# EAGLE design powersense (EAGLE 9.1.2)
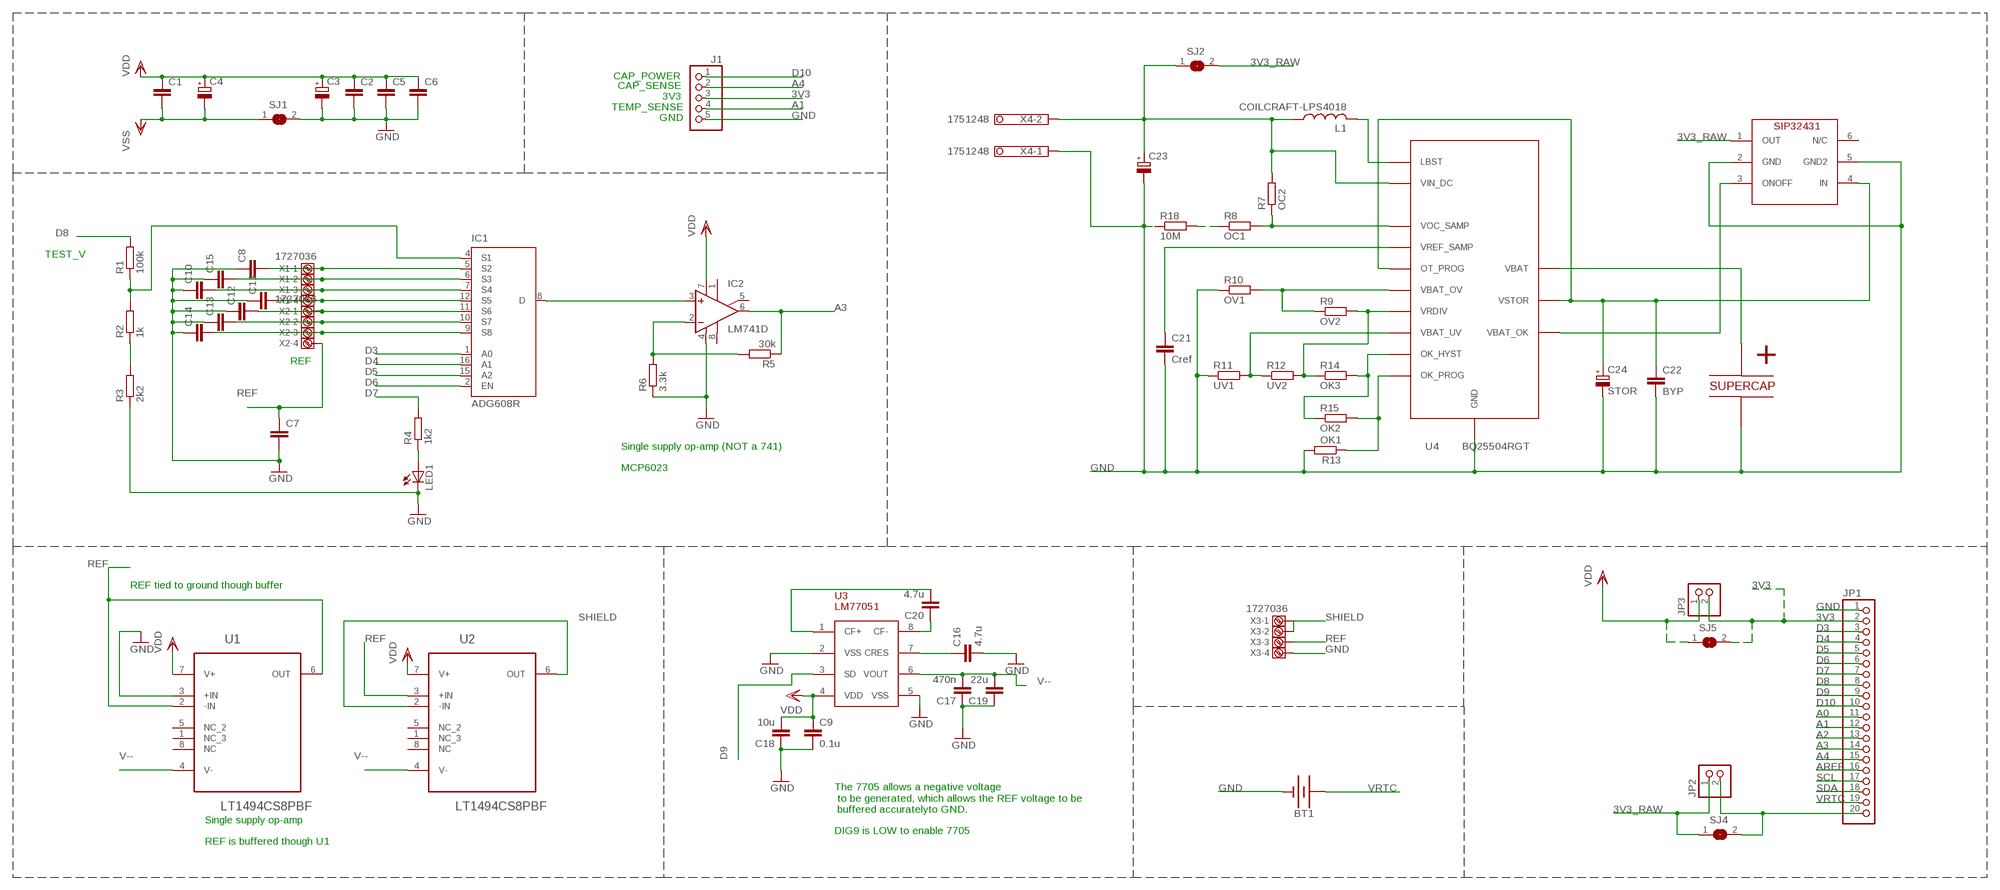
[diagram p0: schematic, sheet 1]

## Parts
BT1  BATTERY-20MM_SMD  [BATTCON_20MM]
C1  C-EUC1206  [C1206]
C2  C-EUC1206  [C1206]
C3  CPOL-EUE5-6  [E5-6]
C4  CPOL-EUE5-6  [E5-6]
C5  C-EUC1206  [C1206]
C6  C-EUC1206  [C1206]
C7  C-EUC1206  [C1206]
C8  C-EUC1206  [C1206]
C9  0.1u  C-EUC1206  [C1206]
C10  C-EUC1206  [C1206]
C11  C-EUC1206  [C1206]
C12  C-EUC1206  [C1206]
C13  C-EUC1206  [C1206]
C14  C-EUC1206  [C1206]
C15  C-EUC1206  [C1206]
C16  4.7u  C-EUC1206  [C1206]
C17  470n  C-EUC1206  [C1206]
C18  10u  C-EUC1206  [C1206]
C19  22u  C-EUC1206  [C1206]
C20  4.7u  C-EUC1206  [C1206]
C21  Cref  C-EUC1206  [C1206]
C22  BYP  C-EUC1206  [C1206]
C23  CPOL-EUE5-6  [E5-6]
C24  STOR  CPOL-EUE5-6  [E5-6]
IC1  ADG608R  [SOIC16N]
IC2  LM741D  [SO08]
J1  PINHD-1X5  [1X05]
JP1  PINHD-1X20  [1X20]
JP2  PINHD-1X2  [1X02]
JP3  PINHD-1X2  [1X02]
L1  COILCRAFT-LPS4018  [LPS4018]
LED1  LEDCHIPLED_0805  [CHIPLED_0805]
R1  100k  R-EU_R1206  [R1206]
R2  1k  R-EU_R1206  [R1206]
R3  2k2  R-EU_R1206  [R1206]
R4  1k2  R-EU_R1206  [R1206]
R5  30k  R-EU_R1206  [R1206]
R6  3.3k  R-EU_R1206  [R1206]
R7  OC2  R-EU_R0603  [R0603]
R8  OC1  R-EU_R0603  [R0603]
R9  OV2  R-EU_R0603  [R0603]
R10  OV1  R-EU_R0603  [R0603]
R11  UV1  R-EU_R0603  [R0603]
R12  UV2  R-EU_R0603  [R0603]
R13  OK1  R-EU_R0603  [R0603]
R14  OK3  R-EU_R0603  [R0603]
R15  OK2  R-EU_R0603  [R0603]
R18  10M  R-EU_R0603  [R0603]
SJ1  SJ  [SJ]
SJ2  SJ  [SJ]
SJ4  SJ  [SJ]
SJ5  SJ  [SJ]
U1  LT1494CS8PBF  [SOIC127P600X175-8N]
U2  LT1494CS8PBF  [SOIC127P600X175-8N]
U3  LM77051  [S-PDSO-G08_N]
U4  BQ25504RGT  [S-PVQFN-N16]
U5  SIP32431DR3  [SC-70-6]
U$2  DDL105S05F1JRRDAPZ  [CAPF1J]
X1  1727036  [1727036]
X2  1727036  [1727036]
X3  1727036  [1727036]
X4  1751248  [1751248]

## Nets
3V3 [PWR]: J1.3 JP1.2 JP3.2 SJ5.2
3V3_RAW: JP2.1 SJ2.2 SJ4.1 U5.1(OUT)
A0: JP1.11
A1: J1.4 JP1.12
A2: JP1.13
A3: IC2.6(OUT) JP1.14 R5.1
A4: J1.2 JP1.15
AREF: JP1.16
D3: IC1.1(A0) JP1.3
D4: IC1.16(A1) JP1.4
D5: IC1.15(A2) JP1.5
D6: IC1.2(EN) JP1.6
D7: JP1.7 R4.2
D8: JP1.8 R1.2
D9: JP1.9 U3.3(SD)
D10: J1.1 JP1.10
GND: BT1.2(-) C2.2 C3.- C5.2 C6.2 C7.2 C8.1 C9.2 C10.1 C11.1 C12.1 C13.1 C14.1 C15.1 C16.2 C17.1 C18.1 C19.1 C21.2 C22.2 C23.- C24.- IC2.4(V-) J1.5 JP1.1 LED1.C R3.1 R6.1 R10.1 R11.1 R13.2 R18.1 SJ1.2 U1.3(+IN) U3.2(VSS) U3.5(VSS) U4.1(GND) U4.12(GND) U4.13(GND) U5.2(GND) U5.5(GND2) U$2.P$2 X3.4 X4.1
JEFF: U4.14(VBAT) U$2.P$1
N$1: IC1.4(S1) R1.1 R2.2
N$2: C8.2 IC1.5(S2) X1.1
N$3: IC2.2(-IN) R5.2 R6.2
N$4: IC1.8(D) IC2.3(+IN)
N$5: R7.1 R8.2 U4.3(VOC_SAMP)
N$6: C20.2 U3.1(CF+)
N$7: C20.1 U3.8(CF-)
N$8: C16.1 U3.7(CRES)
N$9: U4.11(VBAT_OK) U5.3(ONOFF)
N$10: LED1.A R4.1
N$12: C21.1 U4.4(VREF_SAMP)
N$13: R2.1 R3.2
N$14: C22.1 C24.+ U4.5(OT_PROG) U4.15(VSTOR) U5.4(IN)
N$15: R9.1 R10.2 U4.6(VBAT_OV)
N$16: R14.2 R15.1 U4.9(OK_HYST)
N$17: R9.2 R12.2 R14.1 U4.7(VRDIV)
N$18: R11.2 R12.1 U4.8(VBAT_UV)
N$19: R13.1 R15.2 U4.10(OK_PROG)
N$20: L1.2 U4.16(LBST)
N$21: JP1.20 JP2.2 SJ4.2
N$22: C15.2 IC1.6(S3) X1.2
N$23: C10.2 IC1.7(S4) X1.3
N$24: C11.2 IC1.12(S5) X1.4
N$25: C12.2 IC1.11(S6) X2.1
N$26: C13.2 IC1.10(S7) X2.2
N$27: C14.2 IC1.9(S8) X2.3
N$28: R8.1 R18.2
PIN: C23.+ L1.1 R7.2 SJ2.1 U4.2(VIN_DC) X4.2
REF: C7.1 U1.2(-IN) U1.6(OUT) U2.3(+IN) X2.4 X3.3
SCL: JP1.17
SDA: JP1.18
SHIELD [PWR]: U2.2(-IN) U2.6(OUT) X3.1 X3.2
V--: C17.2 C19.2 U1.4(V-) U2.4(V-) U3.6(VOUT)
VDD [PWR]: C1.1 C2.1 C3.+ C4.+ C5.1 C6.1 C9.1 C18.2 IC2.7(V+) JP3.1 SJ5.1 U1.7(V+) U2.7(V+) U3.4(VDD)
VRTC: BT1.1(+) JP1.19
VSS [PWR]: C1.2 C4.- SJ1.1
Unconnected: IC2.1(ON1) IC2.5(ON2) IC2.8(OPT) U1.1(NC_3) U1.5(NC_2) U1.8(NC) U2.1(NC_3) U2.5(NC_2) U2.8(NC) U5.6(N/C)

## Notes on the sheet
- CAP_POWER
- CAP_SENSE
- 3V3
- TEMP_SENSE
- GND
- TEST_V
- REF
- Single supply op-amp (NOT a 741)
- MCP6023
- REF tied to ground though buffer
- The 7705 allows a negative voltage
   to be generated, which allows the REF voltage to be
   buffered accuratelyto GND.
- Single supply op-amp
- DIG9 is LOW to enable 7705
- REF is buffered though U1

## Power pins joined to a net without a drawn wire
GND: IC1.14(GND)
VDD: IC1.13(VDD)
VSS: IC1.3(VSS)

## Library data of the parts
BT1 = SparkFun-Batteries:BATTERY: Battery - Single Cell A variety of battery chemistries, sizes, and footprints. Device List: 20MM_PTH - Coin Cell Battery Holder - 20mm (PTH) <https://www.sparkfun.com/products/783> 20MM_PTH_KIT- Coin Cell battery Holder - 20 mm (PTH) <http://www.sparkfun.com/products/783>kit version with special mask 6.8MM_PTH - Coin Cell Battery Holder - 6.8MM(SMD) <https://www.digikey.com/product-detail/en/seiko-instruments/MS621FE-FL11E/728-1057-ND/1889208?WT.srch=1&gclid=CNOQ5a6LzdQCFZS2wAodXCkE0g> 12MM_SMD - Coin Cell Battery Holder - 12mm (SMD) <https://www.sparkfun.com/products/10592> 12MM_PTH - Coin Cell Battery Holder - 12mm (PTH) <https://www.sparkfun.com/products/7948> 20MM_SMD - 20mm Coin Cell Battery Holder (SMD) (2 legs) Used on the Big Time Watch Kit <https://www.sparkfun.com/products/11734> 20MM_SMD_4LEGS - Coin Cell Battery Holder - 20mm (SMD) <https://www.sparkfun.com/products/11892> 20MM_SMD_4LEGS_OVERPASTE - Coin Cell Battery Holder - 20mm (SMD) <https://www.sparkfun.com/products/11892> (Over-paste on the legs) 24.5MM_PTH - Coin Cell Battery Holder - 24.5mm (PTH) <https://www.sparkfun.com/products/8863> 9V - 9V Battery Holder - PC Mount Used on the SparkFun SparkPunk Sound Kit <https://www.sparkfun.com/products/11177> and SparkFun SparkPunk Sequencer Kit <https://www.sparkfun.com/products/12707> 18650 - Battery Holder - 18650 (PTH) <https://www.sparkfun.com/products/13113> AA - Battery Holder - 1xAA (PTH) <https://www.sparkfun.com/products/7949> AAA - Battery Holder - 1xAAA (PTH) <https://www.sparkfun.com/products/12718> AA_KIT - Battery Holder - 1xAA (PTH) <https://www.sparkfun.com/products/7949> Special kit package - pads only have exposed copper on one side of the board. AAA_KIT - Battery Holder - 1xAAA (PTH) <https://www.sparkfun.com/products/12718> Special kit package - pads only have exposed copper on one side of the board.; PROD_ID: BATT-11519
C1 C2 C5-C22 = rcl:C-EU: CAPACITOR, European symbol
C3 C4 C23 C24 = rcl:CPOL-EU: POLARIZED CAPACITOR, European symbol
IC1 = analog-devices:ADG608: 3 V/5 V, 8 Channel High Performance Analog Multiplexers Source: ADG608_609.pdf
IC2 = linear:*741: OP AMP
J1 = pinhead:PINHD-1X5: PIN HEADER
JP1 = pinhead:PINHD-1X20: PIN HEADER
JP2 JP3 = pinhead:PINHD-1X2: PIN HEADER
L1 = extrapassives:COILCRAFT-LPS4018: Coilcraft Shielded SMT Power Inductors – LPS4018 Series
LED1 = led:LED: LED OSRAM: - CHIPLED LG R971, LG N971, LY N971, LG Q971, LY Q971, LO R971, LY R971 LH N974, LH R974 LS Q976, LO Q976, LY Q976 LO Q996 - Hyper CHIPLED LW Q18S LB Q993, LB Q99A, LB R99A - SideLED LS A670, LO A670, LY A670, LG A670, LP A670 LB A673, LV A673, LT A673, LW A673 LH A674 LY A675 LS A676, LA A676, LO A676, LY A676, LW A676 LS A679, LY A679, LG A679 - Hyper Micro SIDELED® LS Y876, LA Y876, LO Y876, LY Y876 LT Y87S - SmartLED LW L88C, LW L88S LB L89C, LB L89S, LG L890 LS L89K, LO L89K, LY L89K LS L896, LA L896, LO L896, LY L896 - TOPLED LS T670, LO T670, LY T670, LG T670, LP T670 LSG T670, LSP T670, LSY T670, LOP T670, LYG T670 LG T671, LOG T671, LSG T671 LB T673, LV T673, LT T673, LW T673 LH T674 LS T676, LA T676, LO T676, LY T676, LB T676, LH T676, LSB T676, LW T676 LB T67C, LV T67C, LT T67C, LS T67K, LO T67K, LY T67K, LW E67C LS E67B, LA E67B, LO E67B, LY E67B, LB E67C, LV E67C, LT E67C LW T67C LS T679, LY T679, LG T679 LS T770, LO T770, LY T770, LG T770, LP T770 LB T773, LV T773, LT T773, LW T773 LH T774 LS E675, LA E675, LY E675, LS T675 LS T776, LA T776, LO T776, LY T776, LB T776 LHGB T686 LT T68C, LB T68C - Hyper Mini TOPLED® LB M676 - Mini TOPLED Santana® LG M470 LS M47K, LO M47K, LY M47K Source: http://www.osram.convergy.de LUXEON: - LUMILED® LXK2-PW12-R00, LXK2-PW12-S00, LXK2-PW14-U00, LXK2-PW14-V00 LXK2-PM12-R00, LXK2-PM12-S00, LXK2-PM14-U00 LXK2-PE12-Q00, LXK2-PE12-R00, LXK2-PE12-S00, LXK2-PE14-T00, LXK2-PE14-U00 LXK2-PB12-K00, LXK2-PB12-L00, LXK2-PB12-M00, LXK2-PB14-N00, LXK2-PB14-P00, LXK2-PB14-Q00 LXK2-PR12-L00, LXK2-PR12-M00, LXK2-PR14-Q00, LXK2-PR14-R00 LXK2-PD12-Q00, LXK2-PD12-R00, LXK2-PD12-S00 LXK2-PH12-R00, LXK2-PH12-S00 LXK2-PL12-P00, LXK2-PL12-Q00, LXK2-PL12-R00 Source: www.luxeon.com KINGBRIGHT: KA-3528ASYC Source: www.kingbright.com
R1-R15 R18 = rcl:R-EU_: RESISTOR, European symbol
SJ1 SJ2 SJ4 SJ5 = jumper:SJ: SMD solder JUMPER
U1 U2 = LTC_By_element14_Batch_1:LT1494CS8PBF: 1.5mA Max, Single, Dual and Quad Over-The-Top Precision Rail-to-Rail Input and Output Op Amps; MPN: LT1494CS8#PBF; OC_FARNELL: 1663436; OC_NEWARK: 57M4502; PACKAGE: SOIC-8; SUPPLIER: Linear Technology
U3 = texas:LM7705
U4 = BQ25504:BQ25504: TI BQ25504 Ultra Low Power Boost Converter with Battery Management for Energy Harvester Applications; DIGIKEY: 296-29741-1-ND
U5 = SIP32431DR3T1GE3:SIP32431DR3: Ultra Low Leakage and Quiescent Current, 1 A Load Switch with Reverse Blocking
U$2 = supercap:DDL105S05F1JRRDAPZ
X1-X3 = con-phoenix-3.81:1727036: MKDS 1/4-3,81 Source: http://eshop.phoenixcontact.de; MF: FARNELL; MPN: 1727036; OC_FARNELL: 3704592; OC_NEWARK: 71C4114
X4 = con-phoenix-350:1751248: MKDS 1/ 2-3,5 Printklemme Nennstrom: 10 A Bemessungsspannung: 160 V Raster: 3,5 mm Polzahl: 2 Montageart: Löten Anschlussart: Schraubanschluss Anschlussrichtung vom Leiter zur Platine: 0° Source: http://eshop.phoenixcontact.com .. 1751248.pdf; OC_FARNELL: unknown; OC_NEWARK: unknown

## Net classes
0 default: clearance 0.205 mm
1 PWR: width 0.635 mm, clearance 0.205 mm to class 0, clearance 0.205 mm

## Board
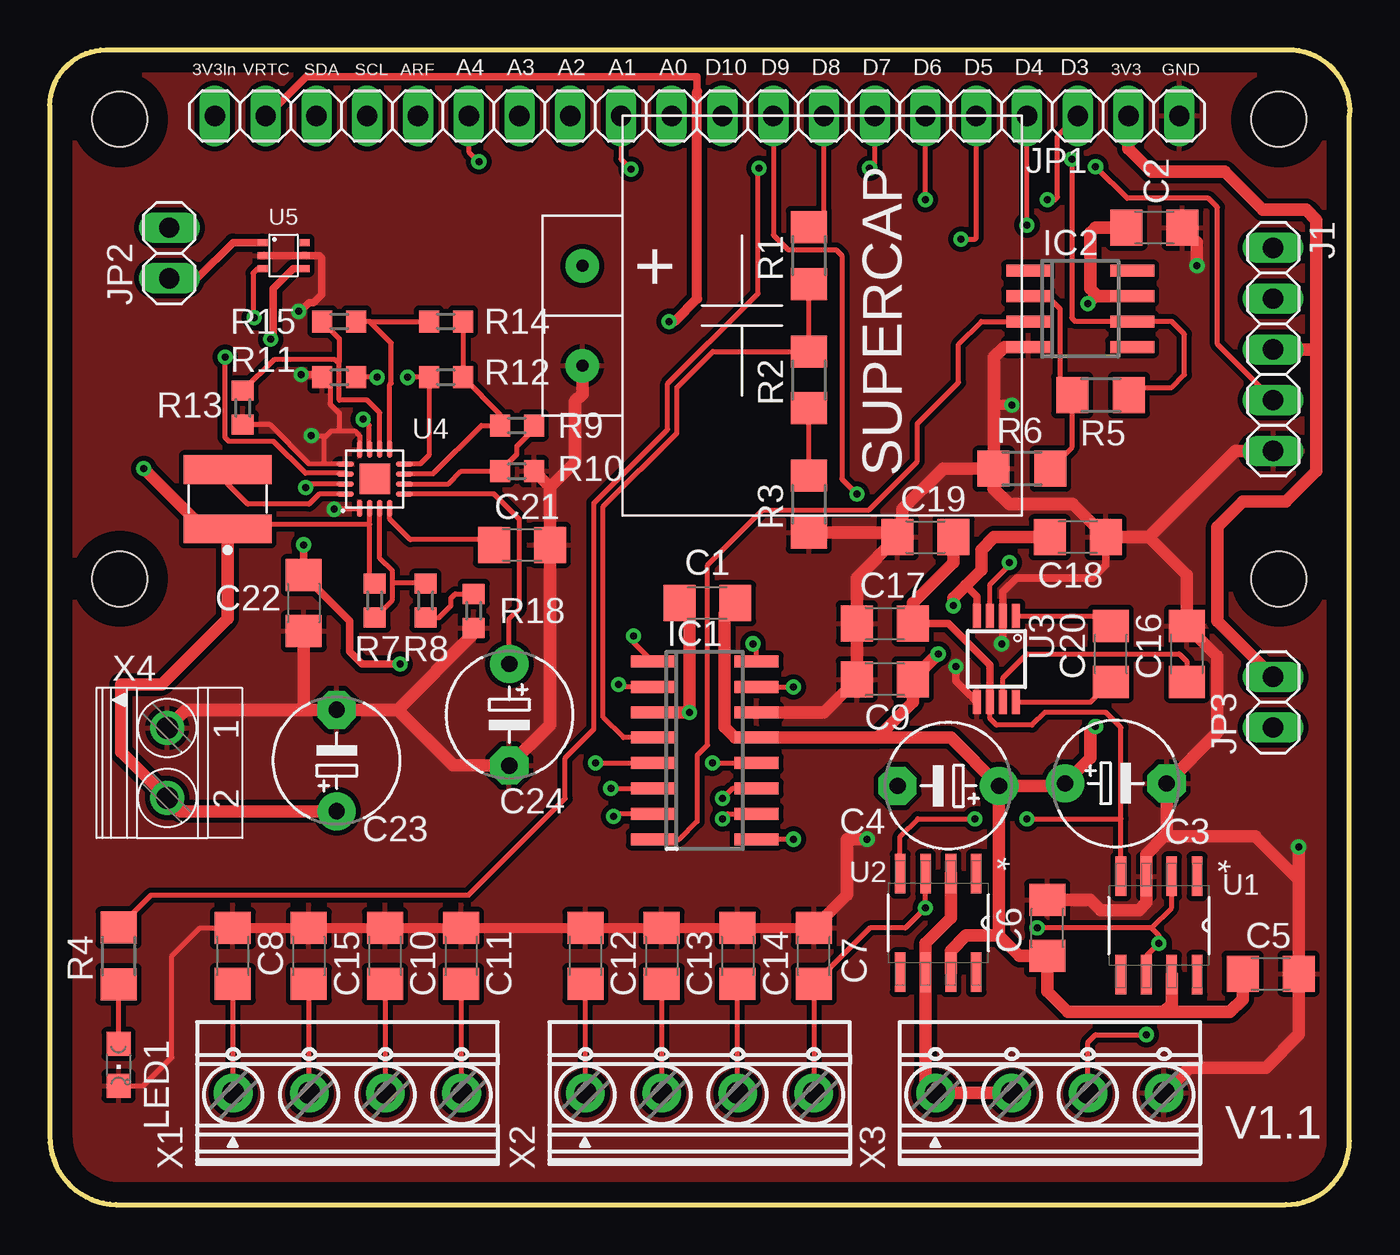
[diagram p1: board, top side]
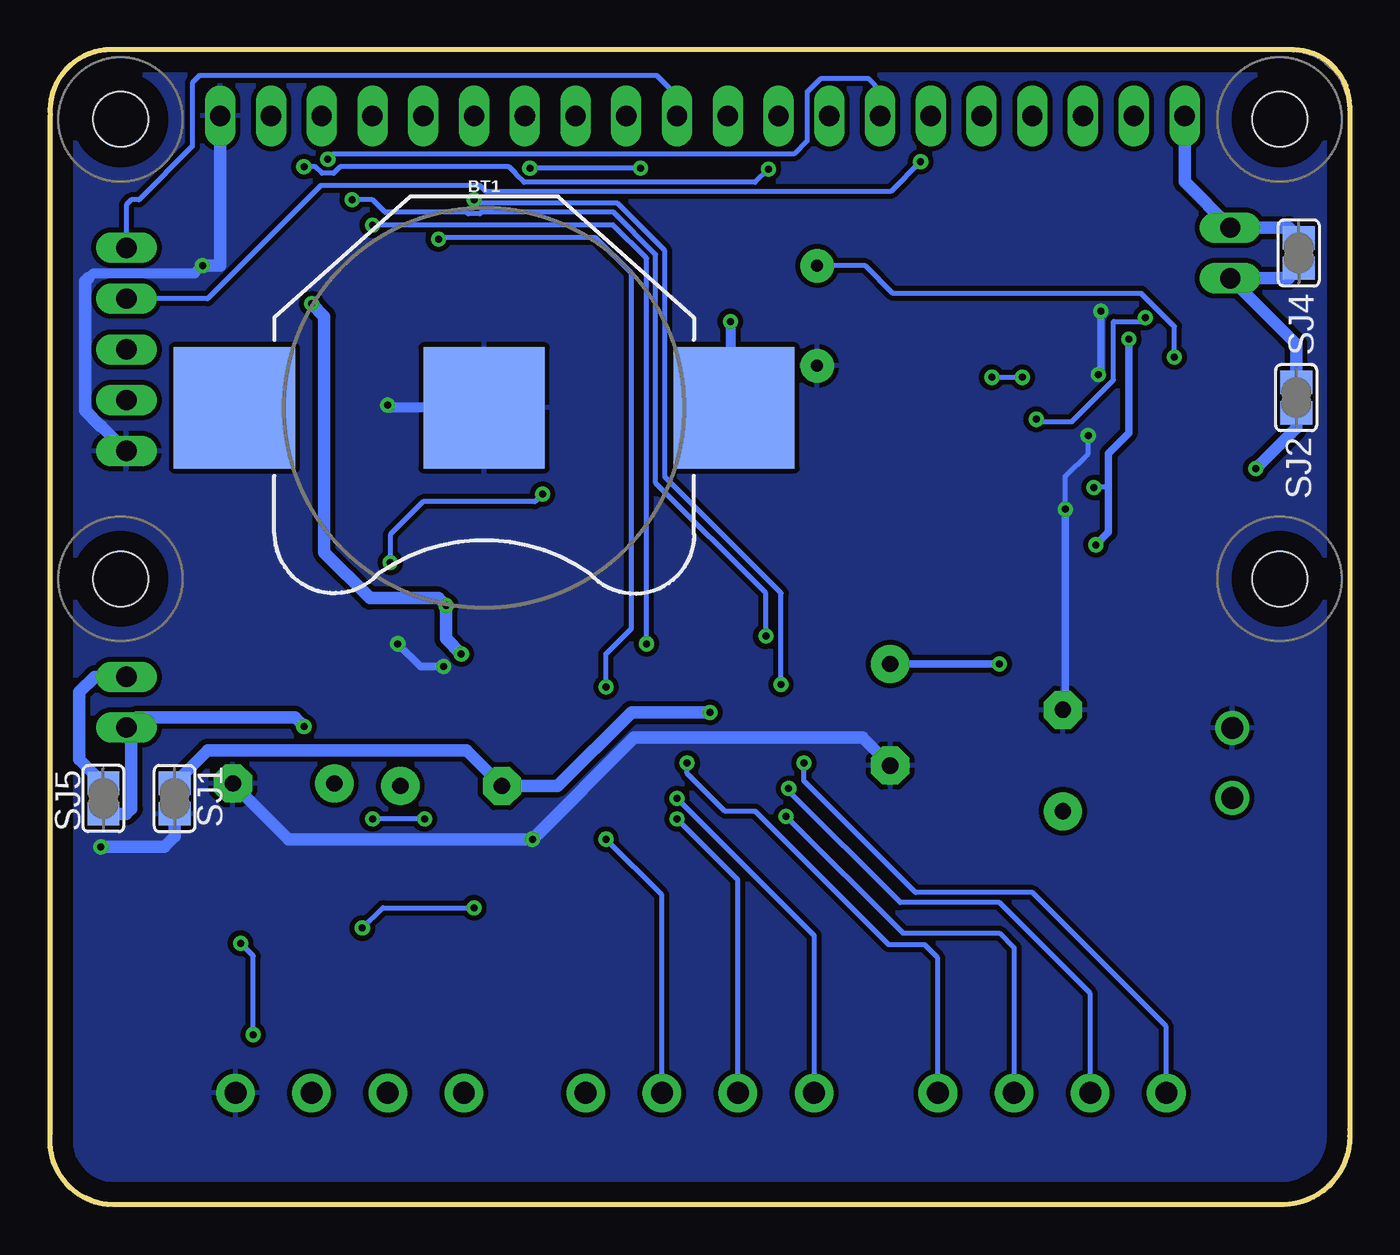
[diagram p2: board, bottom side, seen from below]

Size 65.03 x 57.78 mm. Coordinates in mm from the lower left corner, seen from the top.
Outline: 0,54.99 arc-90 2.79,57.78 62.23,57.78 arc-90 65.02,54.48 65.02,3.18 arc-90 61.85,0 3.3,0 arc-90 0,3.43 0,54.99
Copper layers (1*16): Top 0.035mm / dielectric 1.5mm / Bottom 0.035mm
Design rules "default": minimum track width 6mil, minimum drill 0.35mm, track to track 6mil, track to pad 6mil, pad to pad 6mil, via to via 6mil, smd to smd 6mil, copper to edge 40mil, drill to drill 6mil, minimum pad ring 10mil, minimum via ring 8mil, stop-mask expansion 4mil, vias tented up to drill 0mil, thermal gap 10mil
Holes 2.75 mm at 3.5,31.31 3.5,54.31 61.5,31.31 61.5,54.31

### Footprints (pad centres in the part's own frame; a part is rotated, then mirrored left to right if it is on the bottom)
BATTCON_20MM = smd 6.07 x 6.07: 1 -12.5,0; 2 0,0; 3 12.5,0
C1206 = smd 1.6 x 1.8: 1 -1.4,0; 2 1.4,0
E5-6 = drill 0.813 pad 1.905: + -2.54,0 | drill 0.813 pad 1.905 octagon: - 2.54,0
SOIC16N = smd 0.6 x 2.2: 1 -4.445,-2.6; 2 -3.175,-2.6; 3 -1.905,-2.6; 4 -0.635,-2.6; 5 0.635,-2.6; 6 1.905,-2.6; 7 3.175,-2.6; 8 4.445,-2.6; 9 4.445,2.6; 10 3.175,2.6; 11 1.905,2.6; 12 0.635,2.6; 13 -0.635,2.6; 14 -1.905,2.6; 15 -3.175,2.6; 16 -4.445,2.6
SO08 = smd 0.6 x 2.2: 1 -1.905,-2.6; 2 -0.635,-2.6; 3 0.635,-2.6; 4 1.905,-2.6; 5 1.905,2.6; 6 0.635,2.6; 7 -0.635,2.6; 8 -1.905,2.6
1X05 = drill 1.016 long: 1 -5.08,0; 2 -2.54,0; 3 0,0; 4 2.54,0; 5 5.08,0
1X20 = drill 1.016 long: 1 -24.13,0; 2 -21.59,0; 3 -19.05,0; 4 -16.51,0; 5 -13.97,0; 6 -11.43,0; 7 -8.89,0; 8 -6.35,0; 9 -3.81,0; 10 -1.27,0; 11 1.27,0; 12 3.81,0; 13 6.35,0; 14 8.89,0; 15 11.43,0; 16 13.97,0; 17 16.51,0; 18 19.05,0; 19 21.59,0; 20 24.13,0
1X02 = drill 1.016 long: 1 -1.27,0; 2 1.27,0
LPS4018 = smd 1.435 x 4.394: 1 -1.48,0; 2 1.48,0
CHIPLED_0805 = smd 1.2 x 1.2: A 0,-1.05; C 0,1.05
R1206 = smd 1.6 x 1.803: 1 -1.422,0; 2 1.422,0
R0603 = smd 1 x 1.1: 1 -0.85,0; 2 0.85,0
SJ = smd 1.168 x 1.6: 1 -0.762,0; 2 0.762,0
SOIC127P600X175-8N = smd 1.981 x 0.533: 1 -2.464,1.905; 2 -2.464,0.635; 3 -2.464,-0.635; 4 -2.464,-1.905; 5 2.464,-1.905; 6 2.464,-0.635; 7 2.464,0.635; 8 2.464,1.905
S-PDSO-G08_N = smd 0.4 x 1.2: 1 -0.975,-2.157; 2 -0.325,-2.157; 3 0.325,-2.157; 4 0.975,-2.157; 5 0.975,2.157; 6 0.325,2.157; 7 -0.325,2.157; 8 -0.975,2.157
S-PVQFN-N16 = smd 0.85 x 0.28: 1 -1.475,0.75; 2 -1.475,0.25; 3 -1.475,-0.25; 4 -1.475,-0.75; 9 1.475,-0.75; 10 1.475,-0.25; 11 1.475,0.25; 12 1.475,0.75 | smd 0.28 x 0.85: 5 -0.75,-1.475; 6 -0.25,-1.475; 7 0.25,-1.475; 8 0.75,-1.475; 13 0.75,1.475; 14 0.25,1.475; 15 -0.25,1.475; 16 -0.75,1.475 | smd 1.524 x 1.524: THERMALPAD 0,0
SC-70-6 = smd 0.35 x 0.5: 1 -0.65,-1.05; 2 0,-1.05; 3 0.65,-1.05; 4 0.65,1.05; 5 0,1.05; 6 -0.65,1.05
CAPF1J = drill 0.6 pad 1.676: P$1 7.5,-22; P$2 12.5,-22
1727036 = drill 1.1 pad 1.93: 1 -5.715,0; 2 -1.905,0; 3 1.905,0; 4 5.715,0
1751248 = drill 1.1 pad 1.7: 1 -1.75,-0.1; 2 1.75,-0.1

### Placement (x,y rotation side)
BT1  43.31,39.88 180 bottom
C1  32.89,30.1 180 top
C2  55.27,48.9 0 top
C3  53.34,21.08 0 top
C4  44.96,20.96 180 top
C5  61.09,11.56 0 top
C6  49.91,13.84 90 top
C7  38.23,12.45 90 top
C8  9.14,12.45 270 top
C9  41.78,26.29 180 top
C10  16.76,12.45 270 top
C11  20.57,12.45 270 top
C12  26.8,12.45 270 top
C13  30.61,12.45 270 top
C14  34.42,12.45 270 top
C15  12.95,12.45 270 top
C16  56.9,27.56 90 top
C17  41.78,29.08 0 top
C18  51.43,33.4 180 top
C19  43.82,33.4 0 top
C20  53.09,27.56 90 top
C21  23.62,33.02 0 top
C22  12.7,30.1 270 top
C23  14.35,22.23 90 top
C24  22.99,24.51 270 top
IC1  32.77,22.73 270 top
IC2  51.56,44.83 270 top
J1  61.21,42.8 270 top
JP1  32.38,54.48 180 top
JP2  5.97,47.62 90 top
JP3  61.21,25.15 90 top
L1  8.89,35.31 90 top
LED1  3.43,6.98 180 top
R1  37.97,47.5 90 top
R2  37.97,41.27 90 top
R3  37.97,35.05 90 top
R4  3.43,12.45 90 top
R5  52.58,40.51 180 top
R6  48.64,36.83 0 top
R7  16.26,30.23 90 top
R8  18.8,30.23 90 top
R9  23.37,38.99 180 top
R10  23.37,36.7 180 top
R11  14.48,41.4 0 top
R12  19.81,41.4 0 top
R13  9.65,39.88 270 top
R14  19.81,44.2 180 top
R15  14.48,44.2 180 top
R18  21.21,29.72 90 top
SJ1  58.8,20.32 270 bottom
SJ2  2.67,40.39 90 bottom
SJ4  2.54,47.62 90 bottom
SJ5  62.36,20.32 90 bottom
U1  55.5,13.97 270 top
U2  44.45,14.1 270 top
U3  47.37,27.3 180 top
U4  16.26,36.32 90 top
U5  11.68,47.5 270 top
U$2  48.64,54.48 270 top
X1  14.88,5.59 0 top
X2  32.51,5.59 0 top
X3  50.04,5.59 0 top
X4  5.97,22.1 270 top

### Tracks (layer width: path | path; a pad name or v marks a point on that pad's centre or on a via)
3V3
  Top 0.635: JP1.2 53.98,52.83 55.12,51.69 58.8,51.69 60.71,49.78 62.87,49.78 63.37,49.28 63.37,42.8 | 63.37,42.8 J1.3 | JP3.2 58.42,29.21 58.42,33.91 59.69,35.18 61.85,35.18 63.37,36.7 63.37,42.8
  Bottom 0.635: SJ5.2 63.56,22.29 63.56,25.65 62.8,26.42 JP3.2
3V3_RAW
  Top 0.381: JP2.1 7.37,46.35 9.16,48.15 U5.1
  Bottom 0.635: SJ2.2 2.67,43.05 JP2.1 3.05,46.35 SJ4.1
A1  (via drill 0.35)
  Top 0.254: J1.4 58.42,43.05 58.42,49.91 57.98,50.35 53.91,50.35 v52.32,51.94 | JP1.12 28.57,52.32 v29.08,51.82
  Bottom 0.254: v29.08,51.82 29.74,51.16 41.32,51.16 41.73,51.57 41.73,51.61 42.06,51.94 50.51,51.94 50.84,51.61 51.42,51.61 51.75,51.94 v52.32,51.94
A3  (via drill 0.35)
  Top 0.254: R5.1 54.38,40.89 56.13,40.89 56.77,41.53 56.77,43.56 56.13,44.2 IC2.6 51.31,44.2 51.13,44.38 v51.13,52.32
  Bottom 0.254: JP1.14 23.49,55.78 24.05,56.34 26.49,56.34 27.13,55.7 27.13,53.26 27.81,52.58 50.88,52.58 v51.13,52.32
A4  (via drill 0.35)
  Top 0.254: JP1.15 20.96,52.7 v21.46,52.2
  Bottom 0.254: v21.46,52.2 22.96,50.7 43.22,50.7 43.52,51 51.49,51 57.15,45.34 J1.2
D3  (via drill 0.35)
  Top 0.254: IC1.1 29.21,28.13 v29.21,28.45 | JP1.3 50.42,53.47 50.42,50.42 50.29,50.29 v49.91,50.29
  Bottom 0.254: v29.21,28.45 29.21,30.61 34.72,36.12 34.72,47.55 36.83,49.66 43.45,49.66 43.52,49.58 44.11,49.58 44.18,49.66 48.26,49.66 48.9,50.29 v49.91,50.29
D4  (via drill 0.35)
  Top 0.254: IC1.16 35.37,27.88 v35.18,28.07 | v48.9,49.02 JP1.4
  Bottom 0.254: v48.9,49.02 36.85,49.02 35.18,47.36 v35.18,28.07
D5  (via drill 0.35)
  Top 0.254: IC1.15 v37.21,25.91 | JP1.5 46.35,48.39 46.28,48.31 v45.59,48.31
  Bottom 0.254: v37.21,25.91 37.21,27.56 35.94,28.83 35.94,46.61 37.72,48.39 45.52,48.39 v45.59,48.31
D6  (via drill 0.35)
  Top 0.254: IC1.2 28.57,25.91 v28.45,26.03 | v43.82,50.29 JP1.6
  Bottom 0.254: v28.45,26.03 28.45,30.61 34.26,36.42 34.26,47.74 36.64,50.12 43.64,50.12 v43.82,50.29
D7  (via drill 0.35)
  Top 0.254: R4.2 5.05,15.49 20.96,15.49 25.78,20.32 25.78,22.35 27.23,23.8 27.23,35.12 30.91,38.8 30.91,41.08 32.98,43.16 33,43.16 35.43,45.59 35.43,51.82 v35.49,51.87 | v41.02,51.87 41.27,52.12 JP1.7
  Bottom 0.254: v35.49,51.87 v41.02,51.87
D8
  Top 0.254: R1.2 38.74,49.68 JP1.8
D9  (via drill 0.35)
  Top 0.254: JP1.9 36.2,48.53 36.93,47.79 39.33,47.79 39.62,47.5 39.62,36.32 v40.39,35.56 | U3.3 47.05,31.04 48.01,32 v48.01,32.13
  Bottom 0.254: v40.39,35.56 40.77,35.18 46.35,35.18 48.01,33.53 v48.01,32.13
D10
  Bottom 0.254: JP1.10 33.66,55.5 34.67,56.52 57.53,56.52 57.91,56.13 57.91,52.96 60.58,50.29 60.96,50.29 61.21,50.04 J1.1
GND  (via drill 0.35)
  Top 0.254: LED1.C 4.66,5.94 6.1,7.37 6.1,12.45 7.5,13.85 C8.1 | R13.2 11.01,39.03 12.97,37.07 13.72,37.07 | U4.13 13.72,37.07 | 13.72,37.07 13.72,38.35 13.84,38.48 | 13.84,38.48 14.1,38.73 14.48,38.73 | 14.48,38.73 15.24,38.73 15.51,38.47 U4.12 | R11.1 14.02,41.01 14.02,40.07 14.48,39.61 14.48,38.73 | U4.1 15.46,34.8 v14.22,34.8 | v13.08,38.48 13.84,38.48
  Top 0.381: C18.1 52.84,32.01 52.2,31.37 48.39,31.37 47.7,30.68 U3.2 47.7,28.14 v47.63,28.07 | U3.5 45.34,26.2 v45.34,26.92 | U5.2 U5.5 13.46,47.5 13.59,47.37 13.59,45.55 13.19,45.14 12.96,45.14 12.53,44.7 v12.45,44.7 | R11.1 13.5,41.53 v12.57,41.53
  Top 0.508: C8.1 C15.1 C10.1 C11.1 C12.1 C13.1 C14.1 C7.2 | v48.13,40.01 47.37,40.01 47.24,40.13
  Top 0.635: C6.2 52.07,15.24 52.58,14.73 54.48,14.73 54.86,15.11 U1.3 54.86,17.53 55.75,18.41 | X3.4 57.02,6.86 60.83,6.86 62.49,8.51 C5.2 62.49,16.25 | 55.75,18.41 60.32,18.41 62.49,16.25 | 62.49,16.25 v62.49,17.9 v62.48,17.91 | 55.75,18.41 55.88,18.54 C3.- 58.42,23.62 58.42,27.44 C16.2 56.9,31.5 54.99,33.4 | 54.99,33.4 C18.1 51.18,35.05 48.01,35.05 47.22,35.84 R6.1 | 54.99,33.4 59.31,37.72 J1.5 | C7.2 39.88,15.5 39.88,18.29 v40.89,18.29 | R3.1 42.19,33.63 C19.1 | C19.1 40.38,31.37 C17.1 C9.2 38.73,24.64 IC1.14 | IC2.4 47.75,42.93 47.24,42.42 47.24,40.13 47.24,39.12 47.24,36.85 R6.1 | C19.1 42.67,33.66 42.67,34.8 44.7,36.83 R6.1 | 17.4,24.77 C23.- 12.83,24.77 | X4.1 6.79,24.77 12.83,24.77 | C22.2 12.7,24.89 12.83,24.77 | 25.02,35.9 C21.2 25.02,24.01 C24.- 20.19,21.97 17.4,24.77 | 25.02,35.9 R10.1 | 25.02,35.9 26.29,37.17 26.29,40.22 26.64,40.57 U$2.P$2 | v57.4,46.99 57.4,48.16 C2.2 | R18.1 21.21,28.58 17.4,24.77
  Bottom 0.254: v14.22,34.8 14.22,36.45 13.08,37.59 v13.08,38.48
  Bottom 0.381: v45.34,26.92 46.48,26.92 v47.63,28.07 | v14.22,34.8 14.22,24.89 C23.- | v12.57,41.53 12.45,41.66 v12.45,44.7
  Bottom 0.508: 63.12,46.35 62.87,46.61 57.79,46.61 v57.4,46.99 | BT1.2 48.01,39.88 v48.13,40.01
  Bottom 0.635: C3.- 53.09,18.29 v40.89,18.29 35.81,23.37 24.38,23.37 C24.- | JP1.1 56.52,46.99 v57.4,46.99 | SJ1.2 58.8,18.41 59.31,17.91 v62.48,17.91 | J1.5 62.47,38.97 62.51,38.97 63.26,39.73 63.26,46.21 63.12,46.35
  pour Bottom (isolate 0.254): 2.41,57.78 arc90 0,55.37 0,2.92 arc90 2.92,0 62.23,0 arc90 65.02,2.79 65.02,54.86 arc90 62.1,57.78
  pour Top (isolate 0.254): 2.41,57.78 arc90 0,55.37 0,3.05 arc90 2.92,0.13 62.48,0.13 arc90 64.9,2.54 64.9,55.12 arc90 62.23,57.78
JEFF  (via drill 0.35)
  Top 0.254: U4.14 14.75,36.6 12.79,36.6 11.19,38.2 8.96,38.2 8.76,38.4 v8.76,42.42
  Bottom 0.254: v8.76,42.42 8.76,43.94 10.41,45.59 22.84,45.59 24.23,46.98 U$2.P$1
N$1
  Top 0.254: R1.1 R2.2 33.17,42.7 31.37,40.89 31.37,38.61 27.69,34.92 27.69,24.38 28.7,23.37 IC1.4
N$2  (via drill 0.35)
  Top 0.254: X1.1 9.17,11.05 C8.2 | v27.3,22.1 IC1.5
  Bottom 0.254: X1.1 9.17,8.91 15.88,15.62 21.72,15.62 27.3,21.21 v27.3,22.1
N$3
  Top 0.254: R6.2 51.16,37.92 R5.2 50.55,41.12 50.55,44.83 50.04,45.34 49.09,45.34 IC2.2
N$4
  Top 0.254: IC1.8 31.5,18.29 32.38,19.18 32.38,22.48 32.91,23 32.91,32.01 35.66,34.76 40.97,34.76 43.4,37.19 43.4,39.08 45.47,41.15 45.47,43.05 46.61,44.2 IC2.3
N$5
  Top 0.254: U4.3 16.51,32.35 17.14,31.71 17.14,31.12 | 17.14,31.12 17.14,30.26 R7.1 | R8.2 18.76,31.12 17.14,31.12
N$6
  Top 0.254: U3.1 52.58,29.46 C20.2
N$7
  Top 0.254: U3.8 52.07,25.15 C20.1
N$8
  Top 0.254: U3.7 47.7,26.36 48.9,27.56 56.52,27.56 56.9,27.18 C16.1
N$9  (via drill 0.35)
  Top 0.254: U4.11 15.98,37.83 15.98,39 v15.68,39.3 | U5.3 10.4,46.85 10.16,46.61 10.16,44.45 v10.22,44.39
  Bottom 0.254: v15.68,39.3 15.56,39.18 13.9,39.18 11.81,41.27 11.81,44.2 10.41,44.2 v10.22,44.39
N$10
  Top 0.254: LED1.A R4.1
N$12
  Top 0.254: C21.1 21.97,33.27 18.03,33.27 17.01,34.3 U4.4
N$13
  Top 0.254: R3.2 R2.1
N$14  (via drill 0.35)
  Top 0.254: C24.+ 22.99,29.34 23.49,29.84 23.49,34.29 22.21,35.57 U4.5 | U4.15 13.09,36.07 12.9,35.89 v12.8,35.89
  Top 0.381: U5.4 12.18,46.85 11.18,45.85 11.18,43.44 v11.05,43.31 | v12.7,33.02 C22.1 14.99,29.21 14.99,27.69 15.62,27.05 v17.53,27.05
  Bottom 0.254: v12.8,35.89 12.74,35.94 12.07,35.94
  Bottom 0.381: v12.7,33.02 12.07,33.66 12.07,35.94 12.07,37.59 11.05,38.61 v11.05,43.31 | v17.53,27.05 C24.+
N$15
  Top 0.254: U4.6 19.94,36.07 20.57,36.7 R10.2 23.37,37.55 23.37,37.97 24.22,38.82 R9.1
N$16
  Top 0.254: 16,44.2 R15.1 | 16,44.2 R14.2 | U4.9 17.01,41.03 17.08,41.11 17.08,43.12 16,44.2
N$17
  Top 0.254: U4.7 19.18,36.58 21.59,38.99 R9.2 22.52,39.55 R12.2 R14.1
N$18  (via drill 0.35)
  Top 0.254: U4.8 18.53,37.07 18.96,37.5 R12.1 v17.91,41.4 | v16.37,41.4 R11.2
  Bottom 0.254: v17.91,41.4 v16.37,41.4
N$19
  Top 0.254: R15.2 14.48,43.35 14.48,42.16 | 14.48,42.16 14.48,40.26 15.88,40.26 16.51,39.63 U4.10 | 14.48,42.16 14.39,42.16 14.27,42.28 11.21,42.28 R13.1
N$20
  Top 0.254: U4.16 14.77,35.56 13.47,35.56 12.96,35.05 9.91,35.05 8.89,36.07 L1.2
N$21
  Bottom 0.254: 2.73,48.58 SJ4.2
  Bottom 0.635: 2.73,48.58 3.05,48.9 JP2.2 8.26,51.18 JP1.20
N$22  (via drill 0.35)
  Top 0.254: C15.2 12.95,5.59 X1.2 | v28.07,20.83 IC1.6
  Bottom 0.254: X1.2 12.98,10.57 17.53,15.11 22.48,15.11 28.07,20.7 v28.07,20.83
N$23  (via drill 0.35)
  Top 0.254: X1.3 16.79,11.05 C10.2 | IC1.7 28.33,19.56 v28.2,19.43
  Bottom 0.254: v28.2,19.43 22.36,13.59 17.53,13.59 16.79,12.85 X1.3
N$24  (via drill 0.35)
  Top 0.254: C11.2 20.57,5.59 X1.4 | v33.15,22.1 IC1.12
  Bottom 0.254: X1.4 20.6,12.34 21.26,13 23.05,13 29.73,19.68 31.24,19.68 33.15,21.59 v33.15,22.1
N$25  (via drill 0.35)
  Top 0.254: X2.1 C12.2 | IC1.11 34.16,20.83 v33.66,20.32
  Bottom 0.254: v33.66,20.32 26.8,13.46 X2.1
N$26  (via drill 0.35)
  Top 0.254: C13.2 X2.2 | v33.66,19.3 33.91,19.56 IC1.10
  Bottom 0.254: X2.2 30.61,16.26 v33.66,19.3
N$27  (via drill 0.35)
  Top 0.254: X2.3 C14.2 | v37.21,18.29 IC1.9
  Bottom 0.254: X2.3 34.42,15.49 v37.21,18.29
N$28
  Top 0.254: R8.1 19.47,29.38 20.07,29.97 20.07,30.35 20.28,30.57 R18.2
PIN  (via drill 0.35)
  Top 0.254: R7.2 16.01,31.33 16.01,34.04 | 16.01,34.04 U4.2 | 16.01,34.04 9.1,34.04 L1.1
  Top 0.635: C23.+ 6.53,19.68 X4.2 3.56,22.66 3.56,26.03 5.59,26.03 8.89,29.34 L1.1 7.7,33.83 v4.7,36.83
  Bottom 0.635: v4.7,36.83 2.67,38.86 SJ2.1
REF  (via drill 0.35)
  Top 0.254: X2.4 C7.1 41.02,13.84 42.8,13.84 v43.82,14.86 U2.3 | X3.3 51.94,8.13 52.32,8.51 v54.86,8.51 | U1.2 56.13,14.86 55.12,13.84 | U1.6 54.86,12.45 v55.5,13.08 55.5,13.46 55.12,13.84 | 55.12,13.84 v49.4,13.84
  Bottom 0.254: v54.86,8.51 54.86,12.45 v55.5,13.08 | v49.4,13.84 48.39,14.86 v43.82,14.86
SHIELD
  Top 0.635: X3.2 X3.1 43.82,6.1 U2.6 43.82,13.08 45.09,14.35 U2.2
V--  (via drill 0.35)
  Top 0.254: U2.4 42.55,18.41 43.43,19.3 v46.29,19.3 | U3.6 47.05,24.33 47.37,24 49.15,24 49.78,24.64 52.83,24.64 53.59,23.88 53.59,19.3 | U1.4 53.59,19.3 | v48.9,19.3 53.59,19.3
  Top 0.381: U3.6 47.05,26.99 44.96,29.08 C17.2
  Top 0.635: C17.2 43.18,30.1 45.21,32.13 C19.2
  Bottom 0.254: v46.29,19.3 v48.9,19.3
VDD  (via drill 0.35)
  Top 0.381: U3.4 46.4,30.44 45.85,30.99
  Top 0.635: U2.7 45.09,12.7 45.85,13.46 47.5,13.46 | 47.5,13.46 48.52,12.44 C6.1 49.91,10.67 50.93,9.65 55.75,9.65 | U1.7 56.13,10.03 55.75,9.65 | 55.75,9.65 59.05,9.65 59.69,10.28 C5.1 | 47.5,13.46 C4.+ | C4.+ 50.67,20.96 C3.+ 52.07,22.35 52.07,23.67 v52.32,23.93 | 41.4,23.37 IC1.13 34.29,23.37 33.74,23.91 33.74,29.55 C1.1 | 41.4,23.37 43.18,25.15 C9.1 44.32,27.43 v44.45,27.56 | C4.+ 45.09,23.37 41.4,23.37 | v45.21,29.97 45.21,30.35 45.85,30.99 46.61,31.75 46.61,32.77 47.24,33.4 C18.2 | IC2.7 52.45,45.47 | 52.45,45.47 52.07,45.85 52.07,48.64 52.32,48.9 C2.1 | v51.94,45.09 52.32,45.47 52.45,45.47
  Bottom 0.635: v44.45,27.56 45.21,28.32 v45.21,29.97 45.59,30.35 49.02,30.35 51.31,32.64 51.31,44.45 v51.94,45.09 | SJ5.1 61.21,19.56 60.96,19.81 60.96,23.62 JP3.1 60.71,24.38 52.77,24.38 52.32,23.94 v52.32,23.93
VRTC  (via drill 0.35)
  Top 0.381: JP1.19 10.86,54.48 12.83,56.45 32.38,56.45 32.38,55.7
  Top 0.508: 32.38,55.7 32.38,45.34 31.24,44.2 v30.99,44.2
  Bottom 0.508: v30.99,44.2 30.99,40.06 BT1.1
VSS  (via drill 0.35)
  Top 0.635: IC1.3 v32,24.64 32,29.59 C1.2
  Bottom 0.635: v32,24.64 35.94,24.64 39.62,20.96 C4.- 44.2,22.73 57.15,22.73 SJ1.1

### Text on the board
tPlace: 3V3In | VRTC | SDA | SCL | ARF | A4 | A3 | A2 | A1 | A0 | D10 | D9 | D8 | D7 | D6 | D5 | D4 | D3 | 3V3 | GND | V1.1